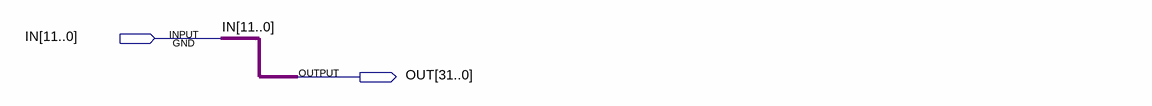
[diagram p0: schematic sheet]
// Quartus schematic signext12_32.bdf as structural Verilog: 0 symbols, 2 pins
module signext12_32 (
  input  [11:0] IN,
  output [31:0] OUT
);


  assign OUT = {{21{IN[11]}}, IN[10:0]};
endmodule
